# Altium project FiltrosGyrator.PrjPcb
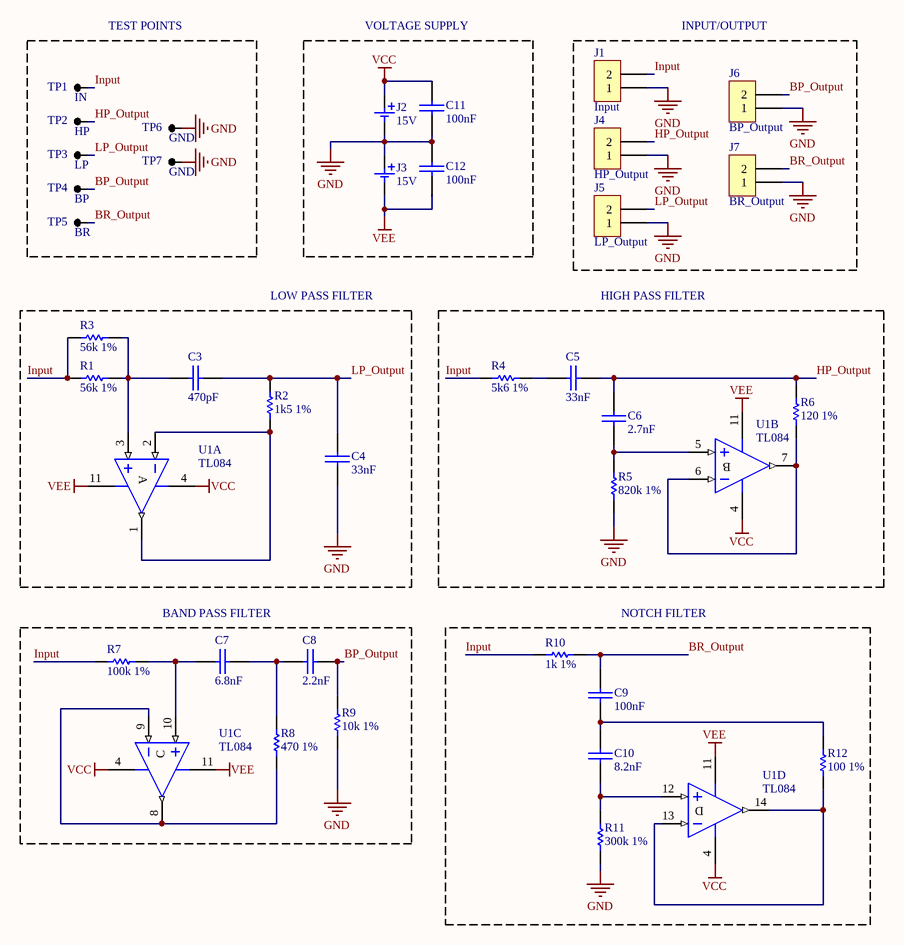
[diagram p0: FiltrosGyrator_SCH.SchDoc]
1 sheet, 37 parts. Net scope: global (net labels, ports and power ports of the same name join across sheets).
Board file: FiltrosGyrator_PCB.PcbDoc

## Sheet FiltrosGyrator_SCH.SchDoc
size A4

### Parts
C3  470pF  [CAP_470p_CERAMIC_THT]
C4  33nF  [CAP_33N_FILM_THT]
C5  33nF  [CAP_33N_FILM_THT]
C6  2.7nF  [CAP_2.7n_FILM_THT]
C7  6.8nF  [CAP_6.8n_FILM_THT]
C8  2.2nF  [CAP_8.2n_FILM_THT]
C9  100nF  [CAP_10N_FILM_THT]
C10  8.2nF  [CAP_8.2n_FILM_THT]
C11  100nF  [0805]
C12  100nF  [0805]
J1  Input  [BORNERA2]
J2  15V  [BORNERA2]
J3  15V  [BORNERA2]
J4  HP_Output  [BORNERA2]
J5  LP_Output  [BORNERA2]
J6  BP_Output  [BORNERA2]
J7  BR_Output  [BORNERA2]
R1  56k 1%  [0805]
R2  1k5 1%  [0805]
R3  56k 1%  [0805]
R4  5k6 1%  [0805]
R5  820k 1%  [0805]
R6  120 1%  [0805]
R7  100k 1%  [0805]
R8  470 1%  [0805]
R9  10k 1%  [0805]
R10  1k 1%  [0805]
R11  300k 1%  [0805]
R12  100 1%  [0805]
TP1  IN  [TPTH]
TP2  HP  [TPTH]
TP3  LP  [TPTH]
TP4  BP  [TPTH]
TP5  BR  [TPTH]
TP6  GND  [TPTH]
TP7  GND  [TPTH]
U1  TL084  [J014]  (parts A,B,C,D of 4)

### Blocks framed on the sheet
TEST POINTS: TP1-TP7
VOLTAGE SUPPLY: C11 C12 J2 J3
INPUT/OUTPUT: J1 J4-J7
LOW PASS FILTER: C3 C4 R1-R3 U1
HIGH PASS FILTER: C5 C6 R4-R6 U1
BAND PASS FILTER: C7 C8 R7-R9 U1
NOTCH FILTER: C9 C10 R10-R12 U1

### Nets
GND: C4.1 C11.2 C12.1 J1.1 J2.2 J3.1 J4.1 J5.1 J6.1 J7.1 R5.1 R9.1 R11.2 TP6.1 TP7.1
VCC: C11.1 J2.1 U1.4(V+)
VEE: C12.2 J3.2 U1.11(V-)
BP_Output: C8.2 J6.2 R9.2 TP4.1
BR_Output: C9.1 J7.2 R10.2 TP5.1
HP_Output: C5.2 C6.1 J4.2 R6.1 TP2.1
Input: J1.2 R1.1 R3.1 R4.1 R7.1 R10.1 TP1.1
LP_Output: C3.2 C4.2 J5.2 R2.2 TP3.1
NetC3_1: C3.1 R1.2 R3.2 U1.3(IN+)
NetC5_1: C5.1 R4.2
NetC6_2: C6.2 R5.2 U1.5(IN+)
NetC7_1: C7.1 R7.2 U1.10(IN+)
NetC7_2: C7.2 C8.1 R8.2
NetC9_2: C9.2 C10.2 R12.2
NetC10_1: C10.1 R11.1 U1.12(IN+)
NetR2_1: R2.1 U1.1(OUT) U1.2(IN-)
NetR6_2: R6.2 U1.6(IN-) U1.7(OUT)
NetR8_1: R8.1 U1.8(OUT) U1.9(IN-)
NetR12_1: R12.1 U1.13(IN-) U1.14(OUT)

### Notes on the sheet
- (in symbol TL084J, part A) A
- (in symbol TL084J, part B) B
- (in symbol TL084J, part C) C
- (in symbol TL084J, part D) D

### Library data of the parts
C3-C12 = CAP
  C3: Footprint: 0805; Value: 470pF
  C4 C5: Footprint: 0805; Value: 33nF
  C6: Footprint: 0805; Value: 2.7nF
  C7: Footprint: 0805; Value: 6.8nF
  C8: Footprint: 0805; Value: 2.2nF
  C9: Footprint: 0805; Value: 100nF
  C10: Footprint: 0805; Value: 8.2nF
  C11 C12: Value: 100nF
J1 J4-J7 = BORNERA 2: Value: BORNERA2
J2 J3 = BATERIA: Value: BORNERA2
R1 R2 R4-R12 = RES
  R1: Value: 56k 1%
  R2: Value: 1k5 1%
  R4: Value: 5k6 1%
  R5: Value: 820k 1%
  R6: Value: 120 1%
  R7: Value: 100k 1%
  R8: Value: 470 1%
  R9: Value: 10k 1%
  R10: Value: 1k 1%
  R11: Value: 300k 1%
  R12: Value: 100 1%
R3 = RES: Value: 0805; Value: 56k 1%
TP1-TP7 = TP: Value: Pin Macho
U1 = TL084J: JFET-Input Operational Amplifier; Published: 16-Jan-2001; LatestRevisionDate: 04-Mar-2005; LatestRevisionNote: Stylized 3D Model Added.; DatasheetVersion: Feb-1999; PackageVersion: Jun-1999; PackageReference: J014; Publisher: Altium Limited; PackageDescription: DIP; 14 Leads; Row Spacing 7.62 mm; Pitch 2.54 mm; ComponentLink1Description: Manufacturer Link; ComponentLink1URL: http://www.ti.com/; ComponentLink2Description: Datasheet; ComponentLink2URL: http://www-s.ti.com/sc/ds/tl084.pdf; Value: TL084